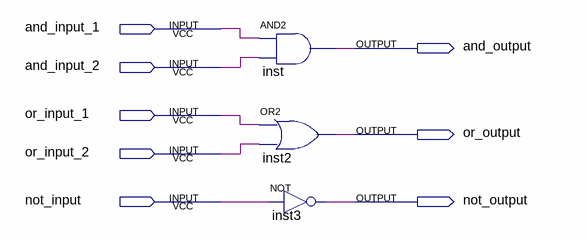
[diagram p0: schematic sheet]
// Quartus schematic firstproject.bdf as structural Verilog: 3 symbols, 8 pins
module firstproject (
  input  and_input_1,
  input  and_input_2,
  input  or_input_1,
  input  or_input_2,
  input  not_input,
  output and_output,
  output or_output,
  output not_output
);

  and inst (and_output, and_input_1, and_input_2);
  or inst2 (or_output, or_input_1, or_input_2);
  not inst3 (not_output, not_input);
endmodule
